# EAGLE schematic EMF_Feedback_v03 (EAGLE 7.0.0)
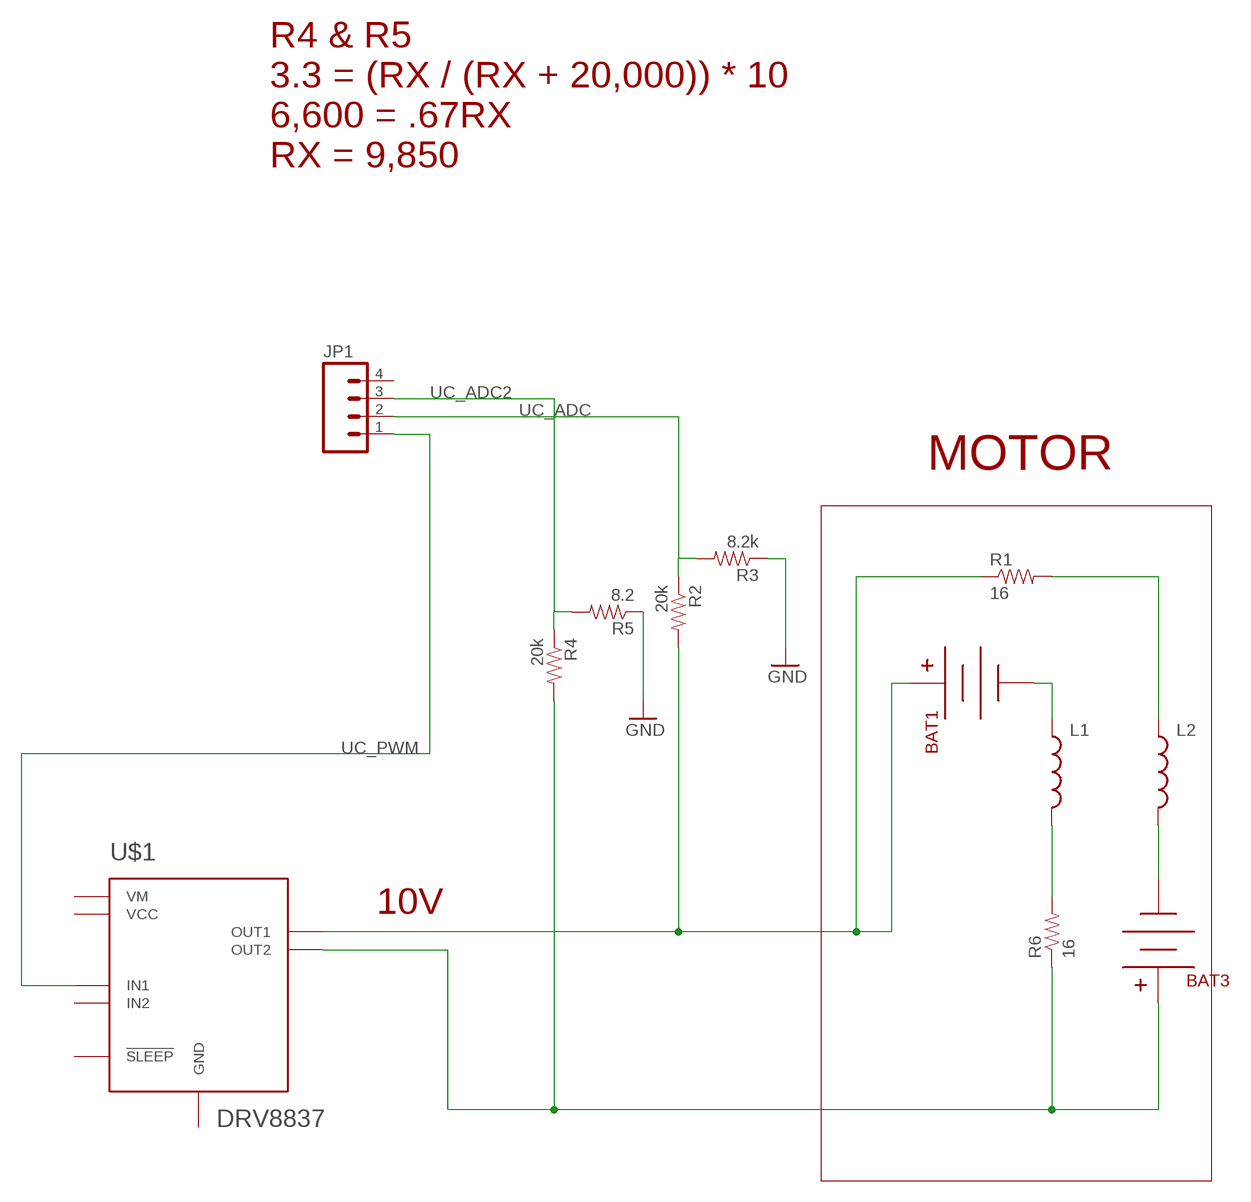
[diagram p0: schematic, sheet 1]

## Parts
BAT1  BC9VPC  [BC9VPC]
BAT3  BC9VPC  [BC9VPC]
JP1  M04PTH  [1X04]
L1  INDUCTOR  [INDUCTOR-SRP4020]
L2  INDUCTOR  [INDUCTOR-SRP4020]
R1  16  RESISTOR0402-RES  [0402-RES]
R2  20k  RESISTOR0402-RES  [0402-RES]
R3  8.2k  RESISTOR0402-RES  [0402-RES]
R4  20k  RESISTOR0402-RES  [0402-RES]
R5  8.2  RESISTOR0402-RES  [0402-RES]
R6  16  RESISTOR0402-RES  [0402-RES]
U$1  DRV8837  [QFN8]

## Nets
GND: R3.1 R5.1
N$1: L1.P$2 R6.2
N$2: L2.P$1 R1.2
N$3: BAT1.V+ R1.1 R2.2 U$1.P$2(OUT1)
N$4: BAT1.V- L1.P$1
N$6: BAT3.V- L2.P$2
N$7: BAT3.V+ R4.2 R6.1 U$1.P$3(OUT2)
UC_ADC: JP1.2 R2.1 R3.2
UC_ADC2: JP1.3 R4.1 R5.2
UC_PWM: JP1.1 U$1.P$6(IN1)
Unconnected: JP1.4 U$1.P$1(VM) U$1.P$4(GND) U$1.P$5(IN2) U$1.P$7(!SLEEP) U$1.P$8(VCC) U$1.P$9(GND) U$1.P$10(GND) U$1.P$11(GND)

## Notes on the sheet
- R4 & R5
  3.3 = (RX / (RX + 20,000)) * 10
  6,600 = .67RX
  RX = 9,850
- MOTOR
- 10V

## Library data of the parts
BAT1 BAT3 = SparkFun-Connectors:BC9VPC: 9V board-mount battery cradle; PROD_ID: BATT-10855
JP1 = SparkFun-Connectors:M04: Header 4 Standard 4-pin 0.1" header. Use with straight break away headers (SKU : PRT-00116), right angle break away headers (PRT-00553), swiss pins (PRT-00743), machine pins (PRT-00117), and female headers (PRT-00115). Molex polarized connector foot print use with SKU : PRT-08231 with associated crimp pins and housings. 1MM SMD Version SKU: PRT-10208
L1 L2 = SparkFun-Passives:INDUCTOR: Inductors Basic Inductor/Choke - 0603 and 1206. Footprints are not proven and vary greatly between part numbers. SRN6045- 33uH, 20% 1.4A SDR0403-560KL - 56uH, 10%, 500mA RMS/740mA peak
R1-R6 = SparkFun-Passives:RESISTOR: Resistor Basic schematic elements and footprints for 0603, 1206, and PTH resistors.
U$1 = bt_motordriver:DRV8837: DRV8837 Low Voltage H-Bridge The DRV8837 provides an integrated motor-driver solution for cameras, consumer products, toys, and other low-voltage or battery-powered motion-control applications. The device has one H-bridge driver, and can drive one dc motor or one winding of a stepper motor, as well as other devices like solenoids. Reference: http://www.ti.com/lit/ds/symlink/drv8837.pdf